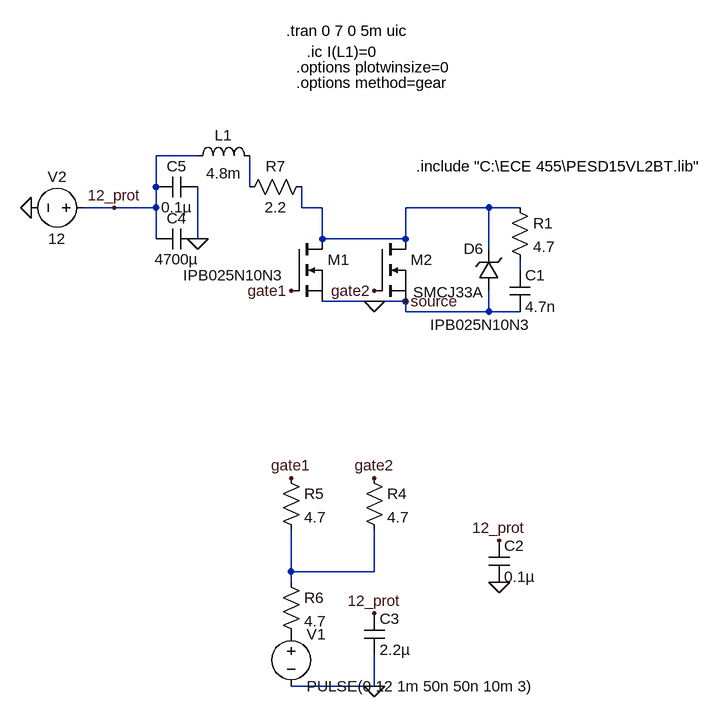
[diagram p0: schematic Polarization_ckt.asc]
Polarization_ckt.asc, the LTspice schematic file:
Version 4
SHEET 1 1696 804
WIRE -272 -32 -336 -32
WIRE -336 16 -336 -32
WIRE -192 16 -192 -32
WIRE -400 48 -448 48
WIRE -336 48 -336 16
WIRE -336 48 -400 48
WIRE -112 48 -112 16
WIRE -80 48 -112 48
WIRE 176 48 48 48
WIRE 224 48 176 48
WIRE -336 96 -336 48
WIRE -272 96 -272 16
WIRE -80 96 -80 48
WIRE 48 96 48 48
WIRE 48 96 -80 96
WIRE 176 112 176 48
WIRE 224 144 224 128
WIRE 0 192 -80 192
WIRE 48 192 0 192
WIRE 48 208 48 192
WIRE 176 208 176 176
WIRE 176 208 48 208
WIRE 224 208 176 208
WIRE -128 608 -128 544
WIRE 0 608 0 544
WIRE 0 608 -128 608
WIRE -128 624 -128 608
WIRE 0 784 0 736
WIRE 0 784 -128 784
FLAG 0 784 0
FLAG -528 48 0
FLAG -128 176 gate1
FLAG 0 176 gate2
FLAG 48 192 source
FLAG 0 192 0
FLAG -272 96 0
FLAG -128 464 gate1
FLAG 0 464 gate2
FLAG -400 48 12_prot
FLAG 192 560 12_prot
FLAG 192 624 0
FLAG 0 672 12_prot
SYMBOL cap 208 144 R0
SYMATTR InstName C1
SYMATTR Value 4.7n
SYMBOL res 208 32 R0
SYMATTR InstName R1
SYMATTR Value 4.7
SYMATTR SpiceLine pwr=2
SYMBOL res -16 448 R0
SYMATTR InstName R4
SYMATTR Value 4.7
SYMATTR SpiceLine pwr=2
SYMBOL res -144 448 R0
SYMATTR InstName R5
SYMATTR Value 4.7
SYMATTR SpiceLine pwr=2
SYMBOL res -144 608 R0
SYMATTR InstName R6
SYMATTR Value 4.7
SYMBOL cap 176 560 R0
SYMATTR InstName C2
SYMATTR Value 0.1µ
SYMBOL cap -16 672 R0
SYMATTR InstName C3
SYMATTR Value 2.2µ
SYMBOL cap -272 80 R90
WINDOW 0 0 32 VBottom 2
WINDOW 3 32 32 VTop 2
SYMATTR InstName C4
SYMATTR Value 4700µ
SYMBOL cap -272 0 R90
WINDOW 0 0 32 VBottom 2
WINDOW 3 32 32 VTop 2
SYMATTR InstName C5
SYMATTR Value 0.1µ
SYMBOL res -96 0 R90
WINDOW 0 0 56 VBottom 2
WINDOW 3 32 56 VTop 2
SYMATTR InstName R7
SYMATTR Value 2.2
SYMBOL nmos -128 96 R0
WINDOW 3 -166 56 Left 2
SYMATTR Value IPB025N10N3
SYMATTR InstName M1
SYMBOL nmos 0 96 R0
WINDOW 3 86 132 Left 2
SYMATTR Value IPB025N10N3
SYMATTR InstName M2
SYMBOL TVSdiode 192 176 R180
WINDOW 0 24 65 Left 2
WINDOW 3 24 -2 Left 2
SYMATTR InstName D6
SYMATTR Value SMCJ33A
SYMBOL voltage -128 688 R0
WINDOW 123 0 0 Left 0
WINDOW 39 0 0 Left 0
SYMATTR InstName V1
SYMATTR Value PULSE(0 12 1m 50n 50n 10m 3)
SYMBOL ind -288 -16 R270
WINDOW 0 32 56 VTop 2
WINDOW 3 5 56 VBottom 2
SYMATTR InstName L1
SYMATTR Value 4.8m
SYMBOL voltage -432 48 R90
WINDOW 0 -32 56 VBottom 2
WINDOW 3 32 56 VTop 2
WINDOW 123 0 0 Left 0
WINDOW 39 0 0 Left 0
SYMATTR InstName V2
SYMATTR Value 12
TEXT 64 -16 Left 2 !.include "C:\\ECE 455\\PESD15VL2BT.lib"
TEXT -136 -224 Left 2 !.tran 0 7 0 5m uic
TEXT -104 -192 Left 2 !.ic I(L1)=0
TEXT -120 -168 Left 2 !.options plotwinsize=0
TEXT -120 -144 Left 2 !.options method=gear

The netlist it stands for:
* Polarization_ckt.asc
C1 N003 0 4.7n
R1 N002 N003 4.7 pwr=2
R4 gate2 N004 4.7 pwr=2
R5 gate1 N004 4.7 pwr=2
R6 N004 P001 4.7
C2 12_prot 0 0.1µ
C3 12_prot 0 2.2µ
C4 0 12_prot 4700µ
C5 0 12_prot 0.1µ
R7 N002 N001 2.2
M1 N002 gate1 0 0 IPB025N10N3
M2 N002 gate2 0 0 IPB025N10N3
D6 0 N002 SMCJ33A
V1 P001 0 PULSE(0 12 1m 50n 50n 10m 3)
L1 12_prot N001 4.8m
V2 12_prot 0 12
.model D D
.lib standard.dio
.model NMOS NMOS
.model PMOS PMOS
.lib standard.mos
.include "C:\ECE 455\PESD15VL2BT.lib"
.tran 0 7 0 5m uic
.ic I(L1)=0
.options plotwinsize=0
.options method=gear
.backanno
.end